# Altium schematic sheet Charger.SchDoc
size 297 x 209 mm; SheetNumber: 7; SheetTotal: 9
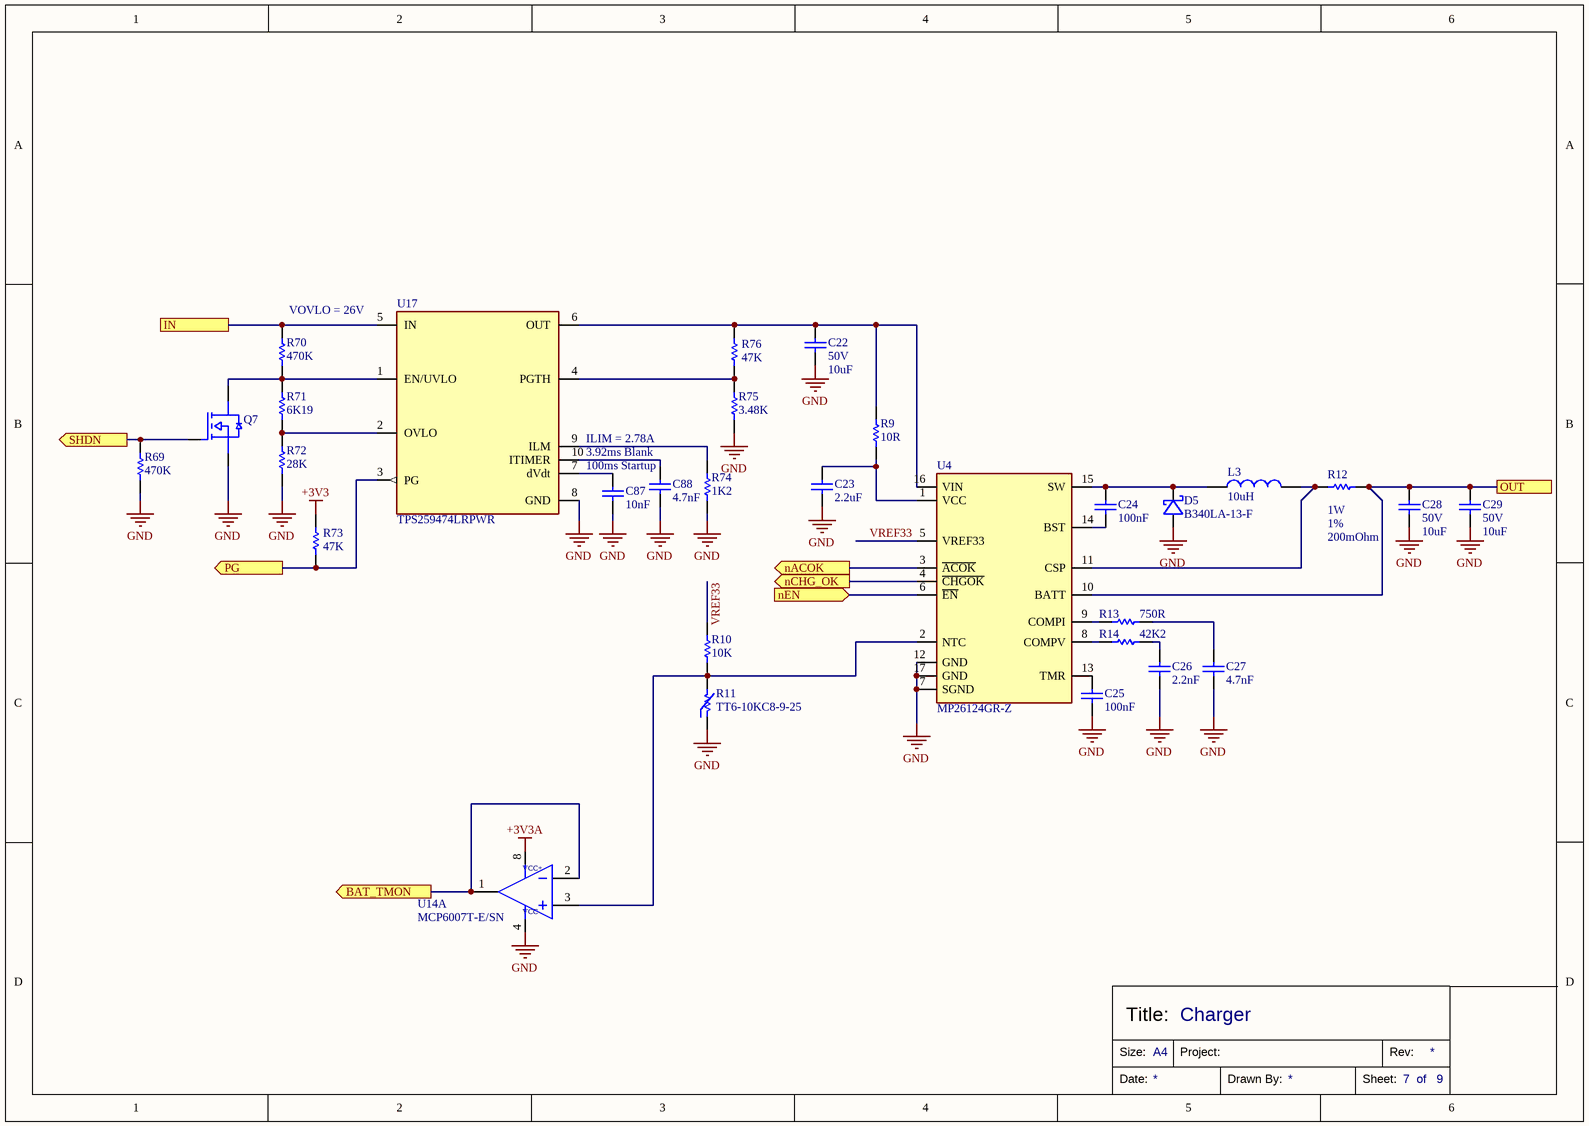
[diagram p0: Charger.SchDoc]

## Parts
C22  Voltage Rating: 50V  Capacitance: 10uF  [CAPC1210X090]  (hidden comment: CL32B106KBJNNNE)
C23  Capacitance: 2.2uF  [CAPC0805X060]  (hidden comment: CL21A225KBFNNNE)
C24  Capacitance: 100nF  [CAPC0603X040]  (hidden comment: C0603C104K5RACTU)
C25  Capacitance: 100nF  [CAPC0603X040]  (hidden comment: C0603C104K5RACTU)
C26  Capacitance: 2.2nF  [CAPC0603X060]  (hidden comment: CL10B222KB8WPNC)
C27  Capacitance: 4.7nF  [CAPC0603X040]  (hidden comment: C0603C472K4RECAUTO)
C28  Voltage Rating: 50V  Capacitance: 10uF  [CAPC1210X090]  (hidden comment: CL32B106KBJNNNE)
C29  Voltage Rating: 50V  Capacitance: 10uF  [CAPC1210X090]  (hidden comment: CL32B106KBJNNNE)
C87  Capacitance: 10nF  [CAPC0603X060]  (hidden comment: CL10B103KB8NNNC)
C88  Capacitance: 4.7nF  [CAPC0603X040]  (hidden comment: C0603C472K4RECAUTO)
D5  B340LA-13-F  [DO-214]
L3  Inductance: 10uH  [1274AS-H-100M=P3]  (hidden comment: 1274AS-H-100M=P3)
Q7  T2N7002AK,LM  [SOT23-3 MOSFET]  (value not drawn)
R9  Resistance: 10R  [RESC0603]  (hidden comment: RMCF0603FT10R0)
R10  Resistance: 10K  [RESC0603]  (hidden comment: RMCF0603FT10K0)
R11  TT6-10KC8-9-25  [TT6-10KC8-9-25]
R12  Power: 1W  Tolerance: 1%  Resistance: 200mOhm  [WSLT2512R2000FEB]  (hidden comment: WSLT2512R2000FEB)
R13  Resistance: 750R  [RESC0603]  (hidden comment: RMCF0603FT750R)
R14  Resistance: 42K2  [RESC0603]  (hidden comment: RMCF0603FT42K2)
R69  Resistance: 470K  [RESC0603]  (hidden comment: RMCF0603FT470K)
R70  Resistance: 470K  [RESC0603]  (hidden comment: RMCF0603FT470K)
R71  Resistance: 6K19  [RESC0603]  (hidden comment: RMCF0603FT6K19)
R72  Resistance: 28K  [RESC0603]  (hidden comment: RMCF0603FT28K0)
R73  Resistance: 47K  [RESC0603]  (hidden comment: RMCF0603FT47K0)
R74  Resistance: 1K2  [RESC0603]  (hidden comment: RMCF0603FT1K2)
R75  Resistance: 3.48K  [RESC0603]  (hidden comment: RMCF0603FT3K48)
R76  Resistance: 47K  [RESC0603]  (hidden comment: RMCF0603FT47K0)
U4  MP26124GR-Z  [qfn-16]
U14  MCP6007T-E/SN  [SOIC-8]  (part A of 2)
U17  TPS259474LRPWR  [VFQFN-10]

## Ports
BAT_TMON (out, see Power_Path[3B], Controller[2B]), IN (see Power_Path[3B], Umbilical_eFuse[2B]), nACOK (out, see Power_Path[3B], Controller[4B]), nCHG_OK (out, see Power_Path[3B], Controller[4B]), nEN (in, see Power_Path[3B]), OUT (see Power_Path[3B], MPPT[6A]), PG (out, see Power_Path[3B]), SHDN (out, see Power_Path[3B])

## Nets
+3V3: R73.2
+3V3A: U14.8(VCC+)
GND: C22.1 C23.1 C25.1 C26.1 C27.1 C28.1 C29.1 C87.2 C88.2 D5.A Q7.S R11.1 R69.1 R72.1 R74.1 R75.1 U4.7(SGND) U4.12(GND) U4.17(GND) U14.4(VCC-) U17.8(GND)
BAT_TMON: U14.1(OUTA) U14.2(INA-) ; port BAT_TMON
IN: R70.2 U17.5(IN) ; port IN
nACOK: U4.3(~{ACOK}) ; port nACOK
nCHG_OK: U4.4(~{CHGOK}) ; port nCHG_OK
nEN: U4.6(~{EN}) ; port nEN
OUT: C28.2 C29.2 R12.2 U4.10(BATT) ; port OUT
PG: R73.1 U17.3(PG) ; port PG
SHDN: Q7.G R69.2 ; port SHDN
VREF33: R10.2 U4.5(VREF33)
NetC22_2: C22.2 R9.2 R76.2 U4.16(VIN) U17.6(OUT)
NetC23_2: C23.2 R9.1 U4.1(VCC)
NetC24_1: C24.1 U4.14(BST)
NetC24_2: C24.2 D5.K L3.1 U4.15(SW)
NetC25_2: C25.2 U4.13(TMR)
NetC26_2: C26.2 R14.1
NetC27_2: C27.2 R13.2
NetC87_1: C87.1 U17.7(dVdt)
NetC88_1: C88.1 U17.10(ITIMER)
NetL3_2: L3.2 R12.1 U4.11(CSP)
NetQ7_D: Q7.D R70.1 R71.2 U17.1(EN/UVLO)
NetR10_1: R10.1 R11.2 U4.2(NTC) U14.3(INA+)
NetR13_1: R13.1 U4.9(COMPI)
NetR14_2: R14.2 U4.8(COMPV)
NetR71_1: R71.1 R72.2 U17.2(OVLO)
NetR74_2: R74.2 U17.9(ILM)
NetR75_2: R75.2 R76.1 U17.4(PGTH)

## Notes on the sheet
- (near R70) VOVLO = 26V
- ILIM = 2.78A
- 3.92ms Blank
- 100ms Startup
- Charger
- Size:
- Title:
- A4
- Project:
- Rev:
- Date:
- Drawn By:
- Sheet:
- of

## Library data of the parts
C22 C28 C29 = CL32B106KBJNNNE: 10 µF ±10% 50V Ceramic Capacitor X7R 1210 (3225 Metric); Manufacturer Part Number: CL32B106KBJNNNE; Distributor Part Number: 1276-3387-1-ND; Tolerance: 10%; Case Code: 1210; Distributor: Digikey
C23 = CL21A225KBFNNNE: 2.2uF ±10% 25V Ceramic Capacitor X7R 0805 (2012 Metric); Part Number: CL21A225KBFNNNE; Distributor Part Number: 1276-6702-1-ND; Tolerance: 10%; Case Code: 0805; Distributor: Digikey; Voltage Rating: 25V
C24 C25 = C0603C104K5RACTU: 0.1 µF ±10% 50V Ceramic Capacitor X7R 0603 (1608 Metric); Part Number: C0603C104K5RACTU; Distributor Part Number: 399-C0603C104K5RACTUCT-ND; Tolerance: 10%; Case Code: 0603; Distributor: Digikey; Voltage Rating: 50V
C26 = CL10B222KB8WPNC: 2.2nF ±10% 50V Ceramic Capacitor X7R 0603 (1608 Metric); Part Number: CL10B222KB8WPNC; Distributor Part Number: 1276-6530-1-ND; Tolerance: 10%; Case Code: 0805; Distributor: Digikey; Voltage Rating: 50V
C27 C88 = C0603C472K4RECAUTO: 4.7nF ±10% 16V Ceramic Capacitor X7R 0603 (1608 Metric); Part Number: C0603C472K4RECAUTO; Tolerance: 10%; Distributor Part number: 399-17879-1-ND; Case Code: 0603; Distributor: Digikey; Dielectric: X7R; Voltage Rating: 16V
C87 = CL10B103KB8NNNC: 10nF ±10% 50V Ceramic Capacitor X7R 0603 (1608 Metric); Part Number: CL10B103KB8NNNC; Distributor Part Number: 1276-1009-1-ND; Tolerance: 10%; Case Code: 0603; Distributor: Digikey; Voltage Rating: 50V
D5 = B340LA-13-F: Diode Schottky 40V 3A 450mV FVf Fast Recovery; Part Number: B340LA-13-F; Distributor: Digikey; Distributor Part Number: B340LA-FDICT-ND; Operating Temperature: -55°C ~ 125°C; Voltage - DC Reverse (Max): 40V; Current - Average Rectified: 3A; Voltage - Foward: 450mV
L3 = 1274AS-H-100M=P3: Inductor 10 µH , 4.4 A 30.4mOhm Max Shielded Drum Core; Current Rating: 4.4A; Saturation Current: 6.2A; Part Number: 1274AS-H-100M=P3; Distributor Part Number: 490-10846-1-ND; Distributor: Digikey; DCR: 30.4mOhm
Q7 = T2N7002AK,LM: N-Channel 60 V 200mA (Ta) 320mW (Ta) Surface Mount SOT-23-3; Drain to Source Voltage: 60V; Rds On (Max) @ Id, Vgs: 3.9ohm; Vgs(th) (Max) @ Id: 2.1V @ 250µA; (Id) @ 25°C: 200mA; Vgs (Max): *; Power Dissipation (Max): 320mW (Ta); Operating Temperature: -55C - 150C; Part Number: T2N7002AK,LM; Distributor Part Number: T2N7002AKLMCT-ND; Distributor: Digikey
R9 = RMCF0603FT10R0: 10 Ohms ±1% 0.1W, 1/10W Chip Resistor 0603 (1608 Metric) Automotive AEC-Q200 Thick Film; Part Number: RMCF0603FT10R0; Tolerance: 1%; Distributor: Digikey; Distributor Part Number: RMCF0603FT10R0CT-ND; Case Code: 0603
R10 = RMCF0603FT10K0: 10 kOhms ±1% 0.1W, 1/10W Chip Resistor 0603 (1608 Metric) Automotive AEC-Q200 Thick Film; Part Number: RMCF0603FT10K0; Tolerance: 1%; Distributor: Digikey; Distributor Part Number: RMCF0603FT10K0CT-ND; Case Code: 0603
R11 = TT6-10KC8-9-25: NTC Thermistor 10k Probe; Part Number: TT6-10KC8-9-25; Distributor Part Number: 1912-TT6-10KC8-9-25-ND; Distributor: Digikey; Operating Temperature: -30°C ~ 120°C; Resistance @ 25C: 10k
R12 = WSLT2512R2000FEB: 200 mOhms ±1% 1W Chip Resistor 2512 (6332 Metric) Anti-Sulfur, Automotive AEC-Q200, Current Sense, Moisture Resistant, Pulse Withstanding Metal Element; Distributor: Digikey; Distributor Part Number: 541-10376-1-ND; Operating Temperature: -65°C ~ 275°C; Package: 2512; Part Number: WSLT2512R2000FEB
R13 = RMCF0603FT750R: 750 Ohms ±1% 0.1W, 1/10W Chip Resistor 0603 (1608 Metric) Automotive AEC-Q200 Thick Film; Part Number: RMCF0603FT750R; Tolerance: 1%; Distributor: Digikey; Distributor Part Number: RMCF0603FT750RCT-ND; Case Code: 0603
R14 = RMCF0603FT42K2: 42.2 kOhms ±1% 0.1W, 1/10W Chip Resistor 0603 (1608 Metric) Automotive AEC-Q200 Thick Film; Part Number: RMCF0603FT42K2; Tolerance: 1%; Distributor: Digikey; Distributor Part Number: RMCF0603FT42K2CT-ND; Case Code: 0603
R69 R70 = RMCF0603FT470K: 470 kOhms ±1% 0.1W, 1/10W Chip Resistor 0603 (1608 Metric) Automotive AEC-Q200 Thick Film; Part Number: RMCF0603FT470K; Tolerance: 1%; Distributor: Digikey; Distributor Part Number: RMCF0603FT470KCT-ND; Case Code: 0603
R71 = RMCF0603FT6K19: 6.19 kOhms ±1% 0.1W, 1/10W Chip Resistor 0603 (1608 Metric) Automotive AEC-Q200 Thick Film; Part Number: RMCF0603FT6K19; Tolerance: 1%; Distributor: Digikey; Distributor Part Number: RMCF0603FT6K19CT-ND; Case Code: 0603
R72 = RMCF0603FT28K0: 28 kOhms ±1% 0.1W, 1/10W Chip Resistor 0603 (1608 Metric) Automotive AEC-Q200 Thick Film; Part Number: RMCF0603FT28K0; Tolerance: 1%; Distributor: Digikey; Distributor Part Number: RMCF0603FT28K0CT-ND; Case Code: 0603
R73 R76 = RMCF0603FT47K0: 47 kOhms ±1% 0.1W, 1/10W Chip Resistor 0603 (1608 Metric) Automotive AEC-Q200 Thick Film; Part Number: RMCF0603FT47K0; Tolerance: 1%; Distributor Part Number: RMCF0603FT47K0CT-ND; Distributor: Digikey; Case Code: 0603
R74 = RMCF0603FT1K2: 1.2 kOhms ±1% 0.1W, 1/10W Chip Resistor 0603 (1608 Metric) Automotive AEC-Q200 Thick Film; Part Number: RMCF0603FT1K2; Tolerance: 1%; Distributor: Digikey; Distributor Part Number: RMCF0603FT1K20CT-ND; Case Code: 0603
R75 = RMCF0603FT3K48: 3.48 kOhms ±1% 0.1W, 1/10W Chip Resistor 0603 (1608 Metric) Automotive AEC-Q200 Thick Film; Part Number: RMCF0603FT3K48; Tolerance: 1%; Distributor: Digikey; Distributor Part Number: RMCF0603FT3K48CT-ND; Case Code: 0603
U4 = MP26124GR-Z: Charger IC Lithium Ion 24V Input, 2A, 600kHz, 4S Cell Switching; Battery Pack Voltage: 16.8V; Part Number: MP26124GR-Z; Distributor: Digikey; Distributor Part Number: 1589-1993-1-ND; Operating Temperature: -20C~125C; Voltage Supply (Max): 24V
U14 = MCP6007T-E/SN: Operational Amplifier general purpose, 2-Circuit 1.8V ~ 5.5V 1MHz; Slew Rate: 1.9V/us; Part Number: MCP6007T-E/SN; Distributor: Digikey; Distributor Part Number: 150-MCP6007T-E/SNCT-ND; Input Voltage: 1.8V ~ 5.5V; Operating Temperature: -40°C ~ 125°C; Gain Bandwidth Product: 1MHz
U17 = TPS259474LRPWR: eFuse 5.5A, 2.7V~23V, 28mOhm, Reverse Current Blocking with Input Reverse Polarity Protection; Part Number: TPS259474LRPWR; Distributor: Digikey; Distributor Part Number: 296-TPS259474LRPWRCT-ND; Operating Temperature: -40°C ~ 125°C; Output Current: 5.5A; Voltage Input: 2.7V~23V